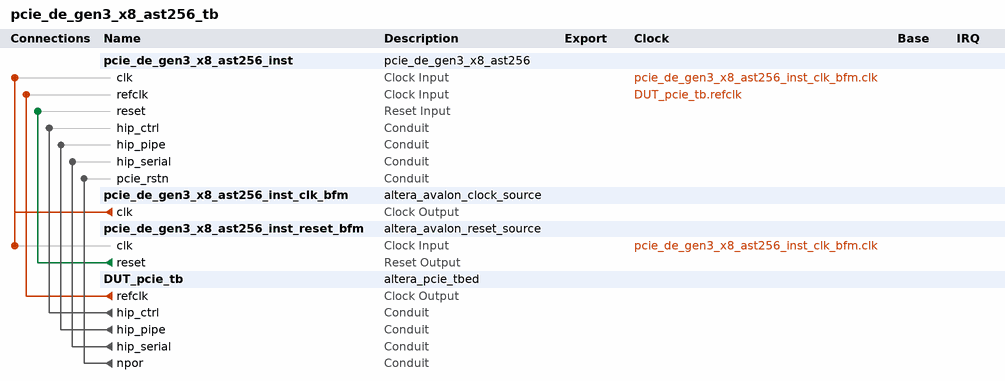
[diagram p0: system contents]
# Platform Designer (Qsys) system pcie_de_gen3_x8_ast256_tb, Stratix V 5SEE9F45C2
# Parameters at their usual value, and those the tool derives, are not listed.
package require -exact qsys 15.1
create_system pcie_de_gen3_x8_ast256_tb
set_project_property DEVICE_FAMILY {Stratix V}
set_project_property DEVICE 5SEE9F45C2

add_instance pcie_de_gen3_x8_ast256_inst pcie_de_gen3_x8_ast256 1.0

add_instance pcie_de_gen3_x8_ast256_inst_clk_bfm altera_avalon_clock_source 15.1

add_instance pcie_de_gen3_x8_ast256_inst_reset_bfm altera_avalon_reset_source 15.1
set_instance_parameter_value pcie_de_gen3_x8_ast256_inst_reset_bfm ASSERT_HIGH_RESET 0
set_instance_parameter_value pcie_de_gen3_x8_ast256_inst_reset_bfm INITIAL_RESET_CYCLES 50

add_instance DUT_pcie_tb altera_pcie_tbed 15.1
set_instance_parameter_value DUT_pcie_tb apps_type_hwtcl 3
set_instance_parameter_value DUT_pcie_tb deemphasis_enable_hwtcl false
set_instance_parameter_value DUT_pcie_tb ecrc_check_capable_hwtcl 0
set_instance_parameter_value DUT_pcie_tb ecrc_gen_capable_hwtcl 0
set_instance_parameter_value DUT_pcie_tb enable_pipe32_phyip_ser_driver_hwtcl 0
set_instance_parameter_value DUT_pcie_tb enable_pipe32_sim_hwtcl 1
set_instance_parameter_value DUT_pcie_tb enable_tl_only_sim_hwtcl 0
set_instance_parameter_value DUT_pcie_tb gen123_lane_rate_mode_hwtcl {Gen3 (8.0 Gbps)}
set_instance_parameter_value DUT_pcie_tb lane_mask_hwtcl x8
set_instance_parameter_value DUT_pcie_tb millisecond_cycle_count_hwtcl 248500
set_instance_parameter_value DUT_pcie_tb pld_clk_MHz 2500
set_instance_parameter_value DUT_pcie_tb pll_refclk_freq_hwtcl {100 MHz}
set_instance_parameter_value DUT_pcie_tb port_type_hwtcl {Native endpoint}
set_instance_parameter_value DUT_pcie_tb serial_sim_hwtcl 1
set_instance_parameter_value DUT_pcie_tb use_crc_forwarding_hwtcl 0
set_instance_parameter_value DUT_pcie_tb use_stratixv_tb_device false

# connections
add_connection DUT_pcie_tb.refclk pcie_de_gen3_x8_ast256_inst.refclk clock
add_connection pcie_de_gen3_x8_ast256_inst_clk_bfm.clk pcie_de_gen3_x8_ast256_inst.clk clock
add_connection pcie_de_gen3_x8_ast256_inst_clk_bfm.clk pcie_de_gen3_x8_ast256_inst_reset_bfm.clk clock
add_connection pcie_de_gen3_x8_ast256_inst_reset_bfm.reset pcie_de_gen3_x8_ast256_inst.reset reset
add_connection DUT_pcie_tb.hip_ctrl pcie_de_gen3_x8_ast256_inst.hip_ctrl conduit
add_connection DUT_pcie_tb.hip_pipe pcie_de_gen3_x8_ast256_inst.hip_pipe conduit
add_connection DUT_pcie_tb.hip_serial pcie_de_gen3_x8_ast256_inst.hip_serial conduit
add_connection DUT_pcie_tb.npor pcie_de_gen3_x8_ast256_inst.pcie_rstn conduit

set_interconnect_requirement {$system} qsys_mm.clockCrossingAdapter HANDSHAKE
set_interconnect_requirement {$system} qsys_mm.enableEccProtection FALSE
set_interconnect_requirement {$system} qsys_mm.insertDefaultSlave FALSE
set_interconnect_requirement {$system} qsys_mm.maxAdditionalLatency 1

save_system pcie_de_gen3_x8_ast256_tb.qsys
